# EasyEDA Pro project 遥控器PCB设计.eprj, schematic 接收器V2_2
Board Name: 接收器V2_轻款_自平衡_V1; Create Date: 2025-06-14; Page Name: P1; Project Name: 遥控器PCB设计; Schematic Name: 接收器V2_2; Update Date: 2025-06-15; Company: 嘉立创EDA; Page Size: A4; Version: V1.0
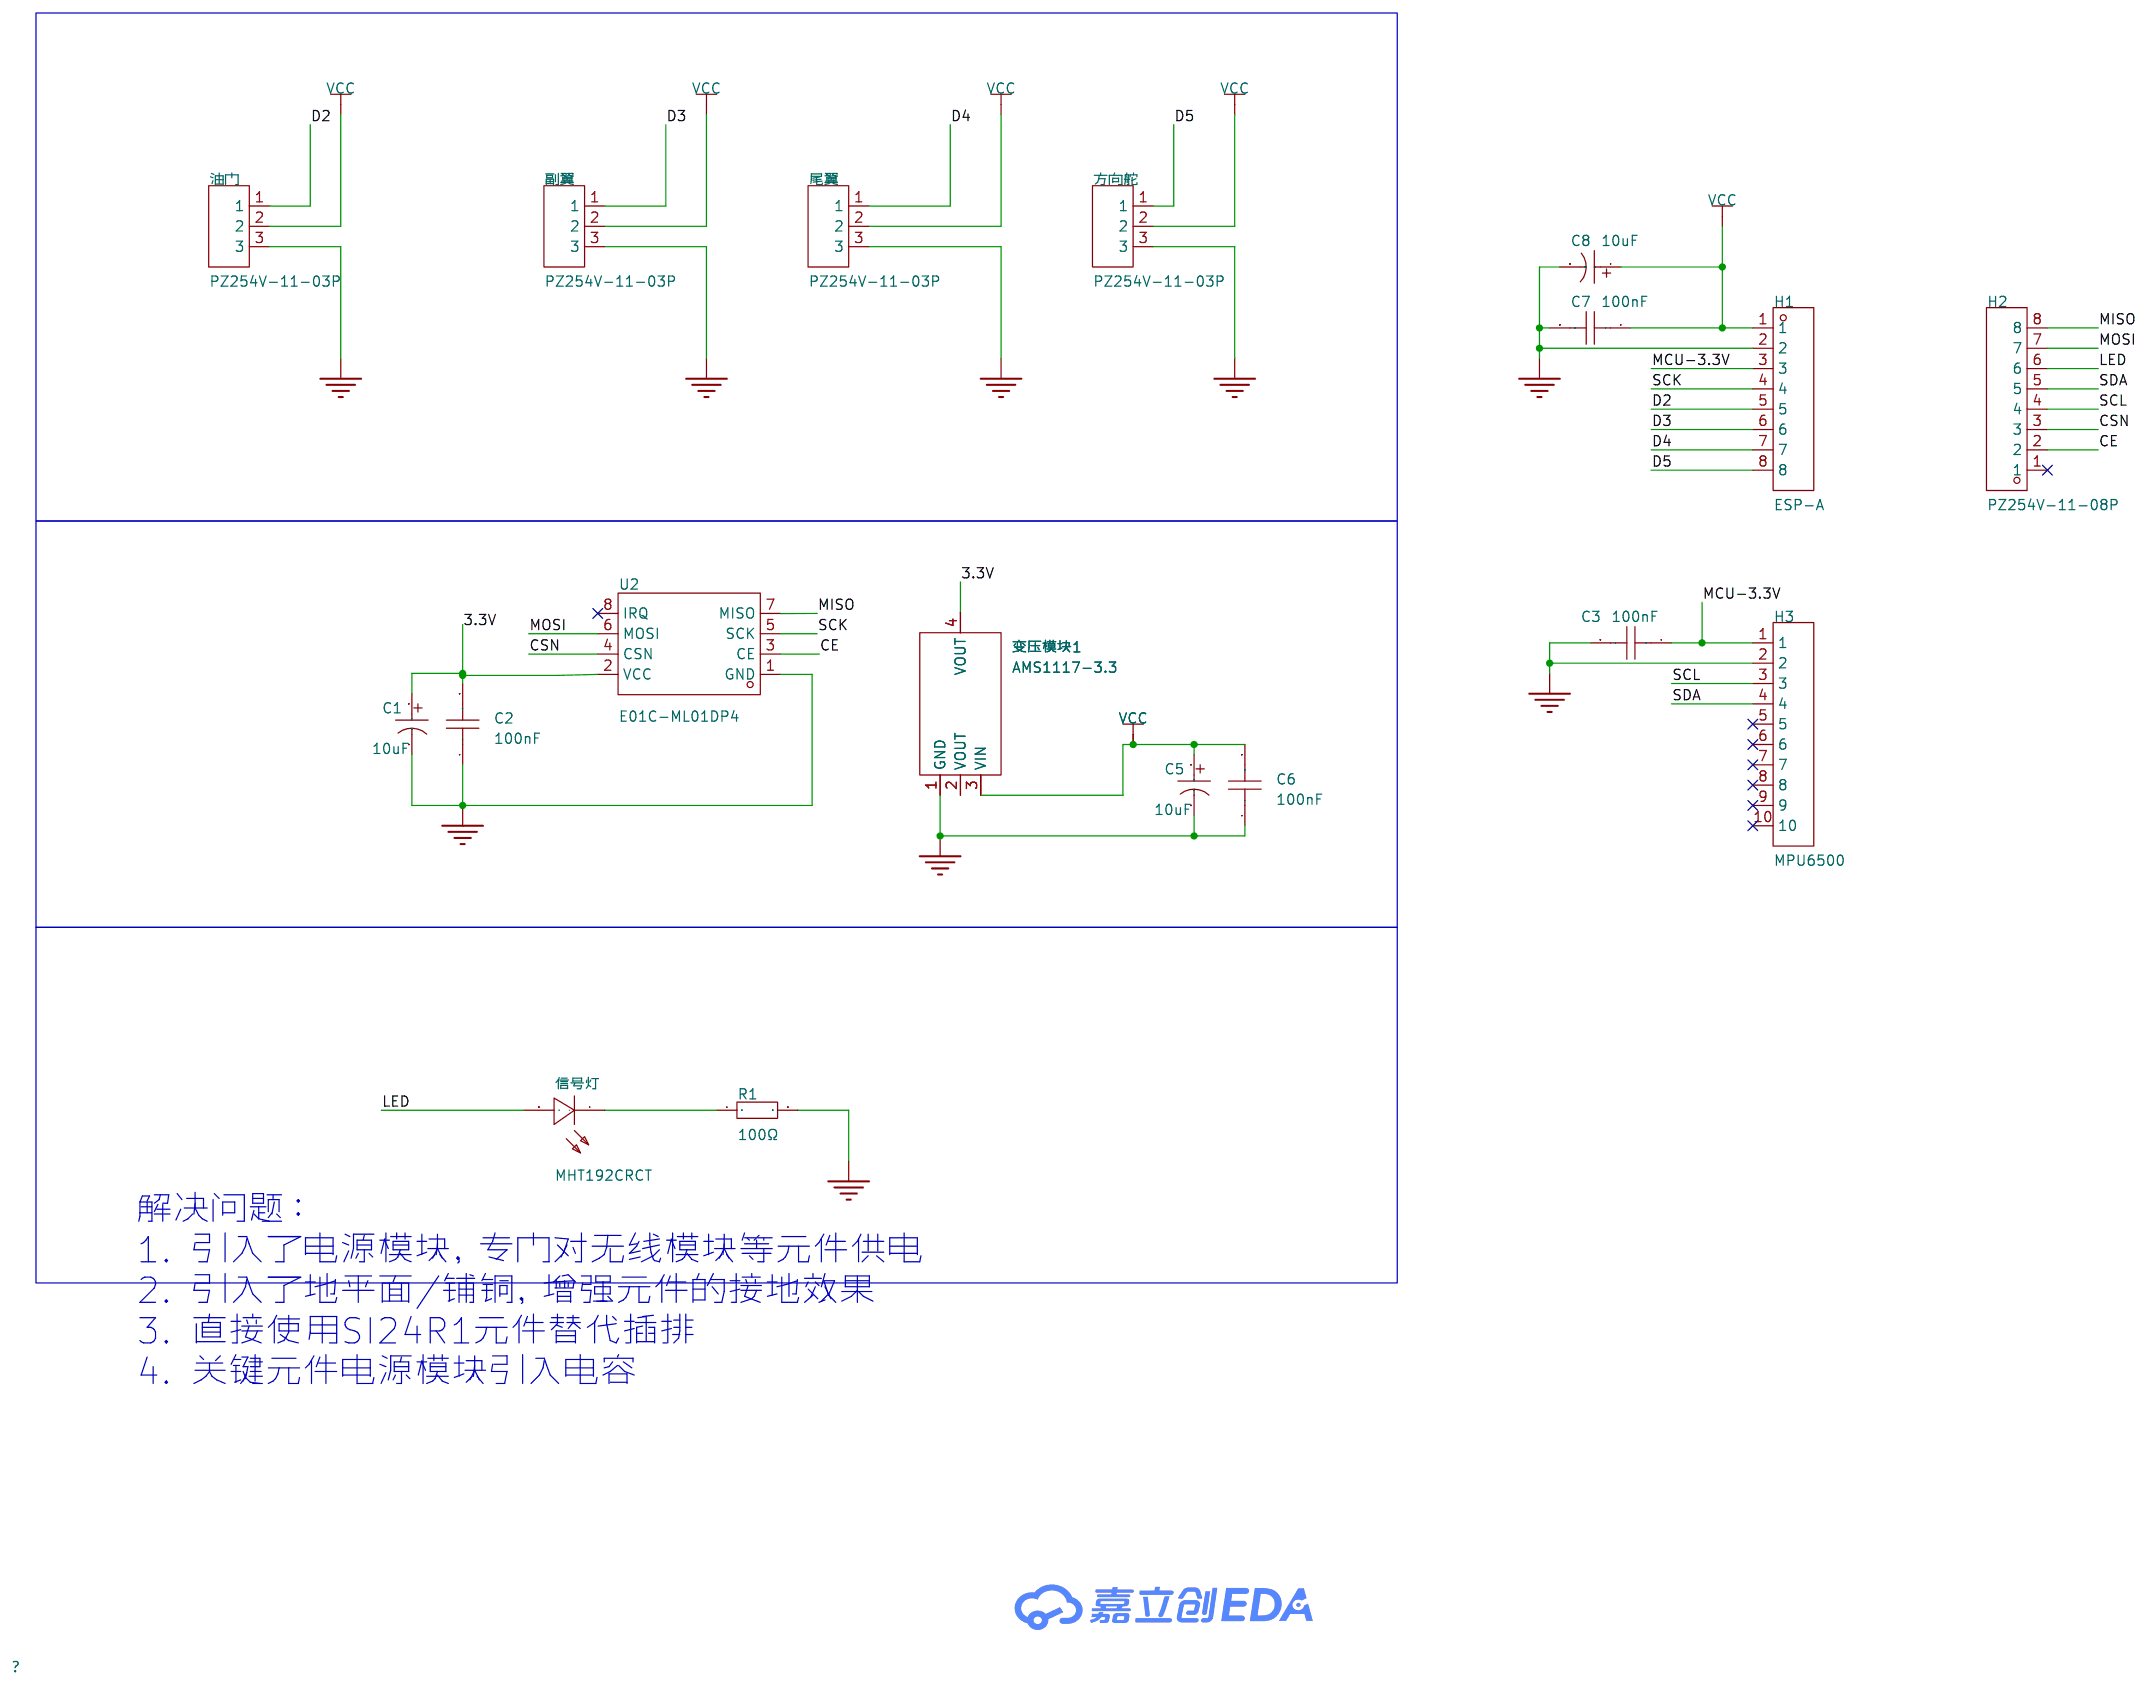
[diagram p7: schematic sheet]

## Parts
C1  10uF  [CAP-SMD_BD6.3-L6.6-W6.6-FD]
C2  100nF  [C0603]
C3  100nF  [C0603]
C5  10uF  [CAP-SMD_BD6.3-L6.6-W6.6-FD]
C6  100nF  [C0603]
C7  100nF  [C0603]
C8  10uF  [CAP-SMD_BD6.3-L6.6-W6.6-FD]
H1  ESP-A  [HDR-TH_8P-P2.54-V-M]
H2  PZ254V-11-08P  [HDR-TH_8P-P2.54-V-M]
H3  MPU6500  [HDR-TH_10P-P2.54-V-M]
R1  100Ω  [R0603]
U2  E01C-ML01DP4  [CONN-TH_E01C-ML01DP4]
信号灯  MHT192CRCT  [LED0603-RD]
副翼  PZ254V-11-03P  [HDR-TH_3P-P2.54-V-M]
变压模块1  AMS1117-3.3  [SOT-223-3_L6.5-W3.4-P2.30-LS7.0-BR]
尾翼  PZ254V-11-03P  [HDR-TH_3P-P2.54-V-M]
方向舵  PZ254V-11-03P  [HDR-TH_3P-P2.54-V-M]
油门  PZ254V-11-03P  [HDR-TH_3P-P2.54-V-M]

## Library data of the parts
C1 C5 C8 = RVT2A100M0607_C72482: 容值:10uF;精度:±20%;额定电压:100V;纹波电流:38mA@120Hz;等效串联电阻(ESR):-;; LCSC Part Name: 10uF ±20% 100V; Supplier Part: C72482; Manufacturer: ROQANG(容强); Manufacturer Part: RVT2A100M0607; Supplier Footprint: SMD,D6.3xL7.7mm; JLCPCB Part Class: 扩展库; Datasheet: https://atta.szlcsc.com/upload/public/pdf/source/20170325/1490427950282.pdf; Supplier: LCSC; Tolerance: ±20%; Voltage Rating: 100V; Ripple Current: 38mA@120Hz; Diameter: 6.3mm; Height - Seated (Max): 7.7mm; Lifetime: 2000hrs@105℃; Operating Temperature: -40℃~+105℃
C2 C3 C6 C7 = CGA0603X7R104K500JT: 容值:100nF;精度:±10%;额定电压:50V;材质(温度系数):X7R;; LCSC Part Name: 100nF ±10% 50V; Supplier Part: C6119867; Manufacturer: HRE(芯声); Supplier Footprint: 0603; JLCPCB Part Class: 扩展库; Supplier: LCSC; Tolerance: ±10%; Voltage Rated: 50V; Temperature Coefficient: X7R
H1 H2 = PZ254V-11-08P: 插针结构:1x8P;间距:2.54mm;行距:-;圆针/方针:方针;安装类型:直插;排数:单排;总PIN位数:8P;额定电流:-;额定电压:-;配合针长度:6mm;塑高:2.5mm;端接针长度:3mm;触头材质:黄铜;触头镀层:-;工作温度范围:-40℃~+105℃;颜色:黑色;; LCSC Part Name: 间距:2.54mm 1x8P 直插 方针; Supplier Part: C492407; Manufacturer: XFCN(兴飞); Supplier Footprint: 插件,P=2.54mm; JLCPCB Part Class: 扩展库; Datasheet: https://atta.szlcsc.com/upload/public/pdf/source/20200309/C492407_83A6FB26A2233368EDB9516968EC6149.pdf; Supplier: LCSC; Pin Structure: 1x8P; Pitch: 2.54mm; Circluar Pins/Square Pins: 方针; Mounting Type: 直插; Number of Rows: 单排; Number of Pins: 8P; Length of Mating Pin: 6mm; Insulation Height: 2.5mm; Length of End Connection Pin: 3mm; Contact Material: 黄铜; Operating Temperature Range: -40℃~+105℃; Color: 黑色
H3 = PZ254V-11-10P: 插针结构:1x10P;间距:2.54mm;行距:-;圆针/方针:方针;安装方式:直插;排数:单排;总PIN位数:10P;额定电流:-;额定电压:-;配合针长度:6mm;塑高:2.5mm;端接针长度:3mm;触头材质:黄铜;触头镀层:-;工作温度:-40℃~+105℃;颜色:黑色;; LCSC Part Name: 1x10P 间距:2.54mm 方针 直插; Supplier Part: C492409; Manufacturer: XFCN(兴飞); Supplier Footprint: 插件,P=2.54mm; JLCPCB Part Class: 扩展库; Datasheet: https://atta.szlcsc.com/upload/public/pdf/source/20200309/C492409_129C9431BDD62EBBBD0A643B6AAB9FBD.pdf; Supplier: LCSC; Pin Structure: 1x10P; Pitch: 2.54mm; Circluar Pins/Square Pins: 方针; Mounting Type: 直插; Number of Rows: 单排; Number of Pins: 10P; Length of Mating Pin: 6mm; Insulation Height: 2.5mm; Length of End Connection Pin: 3mm; Contact Material: 黄铜; Operating Temperature: -40℃~+105℃; Color: 黑色
R1 = 0603WAF1000T5E: 电阻类型:厚膜电阻;阻值:100Ω;精度:±1%;功率:100mW;最大工作电压:75V;温度系数:±200ppm/℃;; LCSC Part Name: 100Ω ±1% 100mW 厚膜电阻; Supplier Part: C22775; Manufacturer: UNI-ROYAL(厚声); Supplier Footprint: 0603; JLCPCB Part Class: 基础库; Datasheet: https://atta.szlcsc.com/upload/public/pdf/source/20200306/C422600_1E6D84923E4A46A82E41ADD87F860B5C.pdf; Supplier: LCSC; Type: 厚膜电阻; Tolerance: ±1%; Power(Watts): 100mW; Overload Voltage (Max): 75V; Temperature Coefficient: ±200ppm/℃; Operating Temperature Range: -55℃~+155℃
U2 = E01C-ML01DP4: LCSC Part Name: 2.4GHz无线数传收发模块国产Si24R1+PA+LNA透传兼容nRF24L01芯片; Supplier Part: C2971735; Manufacturer: EBYTE(亿佰特); JLCPCB Part Class: 扩展库; Datasheet: https://atta.szlcsc.com/upload/public/pdf/source/20220121/D9792ACC960E5020CE942AB172FD005C.pdf; Supplier: LCSC
信号灯 = MHT192CRCT: 发光颜色:红色;功率:60mW;正向电流:5mA;主波长:621.5nm~633.5nm;二极管配置:-;透镜颜色:无色透明透镜;色温:-;发光角度:120°;载带方式:-;工作温度:-40℃~+85℃;; LCSC Part Name: 红灯; Supplier Part: C389517; Manufacturer: MEIHUA(美华); Supplier Footprint: 0603; JLCPCB Part Class: 扩展库; Datasheet: https://atta.szlcsc.com/upload/public/pdf/source/20190515/C389517_475281E0F1091F4CD4C8D85EF0064C5B.pdf; Supplier: LCSC; Emitted Color: 红色; Power Dissipation: 60mW; Forward Current: 5mA; Dominant Wavelength: 621.5nm~633.5nm; Peak Wavelength: 639nm; Lens Color: 无色透明透镜; Viewing Angle: 120°; Operating Temperature: -40℃~+85℃
副翼 尾翼 方向舵 油门 = PZ254V-11-03P: 插针结构:1x3P;间距:2.54mm;行距:-;圆针/方针:方针;安装方式:直插;排数:单排;总PIN位数:3P;额定电流:3A;额定电压:250V;配合针长度:6mm;塑高:2.5mm;端接针长度:3mm;工作温度:-40℃~+105℃;颜色:黑色;; LCSC Part Name: 1x3P 间距:2.54mm 方针 直插; Supplier Part: C2937625; Manufacturer: XFCN(兴飞); Supplier Footprint: 插件,P=2.54mm; JLCPCB Part Class: 扩展库; Datasheet: https://atta.szlcsc.com/upload/public/pdf/source/20200309/C492402_8335C3D49C4E4C618838D59BB1D024C1.pdf; Supplier: LCSC; Pin Structure: 1x3P; Pitch: 2.54mm; Circluar Pins/Square Pins: 方针; Mounting Type: 直插; Number of Rows: 单排; Number of Pins: 3P; Current Rating: 3A; Voltage Rating (Max): 250V; Length of Mating Pin: 6mm; Insulation Height: 2.5mm; Length of End Connection Pin: 3mm; Operating Temperature: -40℃~+105℃; Color: 黑色
变压模块1 = AMS1117-3.3_C6186: 输出类型:固定;工作电压:-;输出电压:3.3V;输出电流:1A;电源纹波抑制比(PSRR):72dB@(120Hz);输出极性:正极;; LCSC Part Name: 输出3.3V 1A; Supplier Part: C6186; Manufacturer: AMS; Supplier Footprint: SOT-223; JLCPCB Part Class: Basic Part; Datasheet: https://atta.szlcsc.com/upload/public/pdf/source/20180727/C6186_7A095716F0823C02F1997A905E26C086.pdf; Supplier: LCSC; Output Type: 固定; Output Voltage: 3.3V; Output Current: 1A; Power Supply Rejection Ratio (PSRR): 72dB@(120Hz); Voltage Dropout: 1.3V@(800mA); Features: 过流保护(OCP)；热关断(TSD); Output Configuration: 正极; Number of Outputs: 1

## Nets
3.3V: C1.1 C2.2 U2.2(VCC) 变压模块1.4(VOUT)
GND: C1.2 C2.1 C3.2 C5.2 C6.1 C7.2 C8.2 H1.2 H3.2 R1.2 副翼.3 变压模块1.1(GND) 尾翼.3 方向舵.3 油门.3
VCC: C5.1 C6.2 C7.1 C8.1 H1.1 副翼.2 变压模块1.3(VIN) 尾翼.2 方向舵.2 油门.2
CE: H2.2 U2.3(CE)
CSN: H2.3 U2.4(CSN)
D2: H1.5 油门.1
D3: H1.6 副翼.1
D4: H1.7 尾翼.1
D5: H1.8 方向舵.1
LED: H2.6 信号灯.2(+)
MCU-3.3V: C3.1 H1.3 H3.1
MISO: H2.8
MOSI: H2.7 U2.6(MOSI)
SCK: H1.4 U2.5(SCK)
SCL: H2.4 H3.3
SDA: H2.5 H3.4
$1N1244: R1.1 信号灯.1(-)

Not connected (* = marked no-connect by the designer): H2 1*; H3 5* 6* 7* 8* 9* 10*; U2 1(GND) 7(MISO) 8(IRQ)*; 变压模块1 2(VOUT)

## Notes on the sheet
- 解决问题：
  1. 引入了电源模块，专门对无线模块等元件供电
  2. 引入了地平面/铺铜，增强元件的接地效果
  3. 直接使用SI24R1元件替代插排
  4. 关键元件电源模块引入电容
